# Altium schematic sheet MicroSDCard.SchDoc
size A4; Revision: B.2(PCB.SCH)
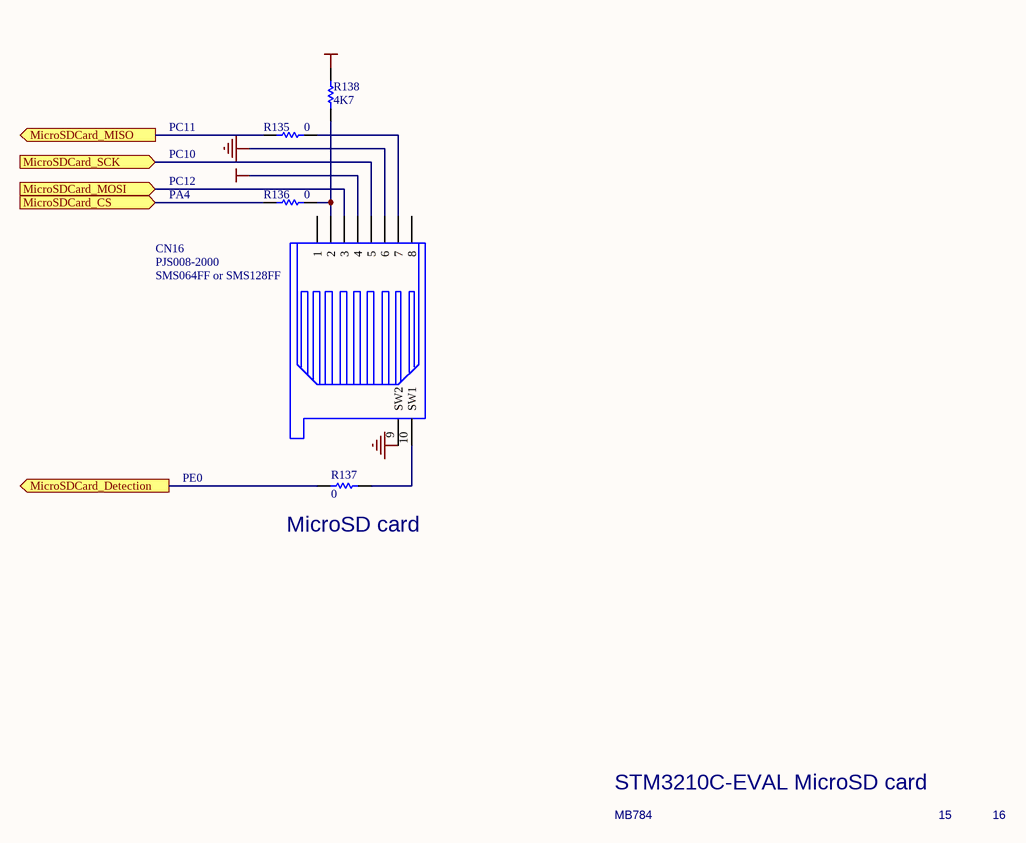
[diagram p0: MicroSDCard.SchDoc]

## Parts
CN16  PJS008-2000  [MSD(PJS008)]
R135  0  [0603R]
R136  0  [0603R]
R137  0  [0603R]
R138  4K7  [0603R]

## Ports
MicroSDCard_CS (in), MicroSDCard_Detection (out), MicroSDCard_MISO (out), MicroSDCard_MOSI (in), MicroSDCard_SCK (in)

## Nets
+3V3: CN16.4 R138.2
GND: CN16.6 CN16.9(SW2)
MicroSDCard_CS: R136.2 ; port MicroSDCard_CS
MicroSDCard_Detection: R137.1 ; port MicroSDCard_Detection
MicroSDCard_MISO: R135.1 ; port MicroSDCard_MISO
MicroSDCard_MOSI: CN16.3 ; port MicroSDCard_MOSI
MicroSDCard_SCK: CN16.5 ; port MicroSDCard_SCK
NetCN16_2: CN16.2 R136.1 R138.1
NetCN16_7: CN16.7 R135.2
NetCN16_10: CN16.10(SW1) R137.2

Not connected (* = marked no-connect by the designer): CN16 1 8

## Notes on the sheet
- PC11
- PC10
- PC12
- PA4
- (near CN16) SMS064FF or SMS128FF
- PE0
- (near R137) MicroSD card
- STM3210C-EVAL MicroSD card
- MB784
- 15
- 16
- STMicroelectronics
- Title:
- Number:
- Rev:
- Date:
- Sheet       of

## Library data of the parts
CN16 = SMS016AFA5E
R135-R138 = Res1: Resistor; Value: 1K; Published: 8-Jun-2000; Revision: July-2002: Re-released for DXP Platform.; Publisher: Altium Limited